# EAGLE schematic silentfan_with_relay (EAGLE 9.5.0)
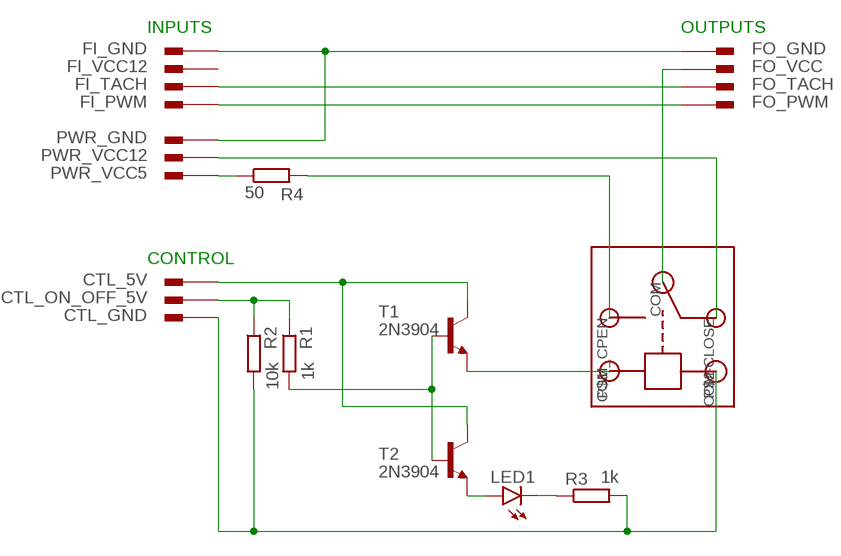
[diagram p0: schematic, sheet 1]

## Parts
CTL_5V  PIN1-2  [62221]
CTL_GND  PIN1-2  [62221]
CTL_ON_OFF_5V  PIN1-2  [62221]
FI_GND  PIN1-2  [62221]
FI_PWM  PIN1-2  [62221]
FI_TACH  PIN1-2  [62221]
FI_VCC12  PIN1-2  [62221]
FO_GND  PIN1-2  [62221]
FO_PWM  PIN1-2  [62221]
FO_TACH  PIN1-2  [62221]
FO_VCC  PIN1-2  [62221]
LED1  LED3MM  [LED3MM]
PWR_GND  PIN1-2  [62221]
PWR_VCC5  PIN1-2  [62221]
PWR_VCC12  PIN1-2  [62221]
R1  1k  R-EU_0204/2V  [0204V]
R2  10k  R-EU_0204/2V  [0204V]
R3  1k  R-EU_0204/2V  [0204V]
R4  50  R-EU_0309/12  [0309/12]
T1  2N3904  [TO92]
T2  2N3904  [TO92]
U$1  RELAY  [RELAY]

## Nets
N$1: FI_GND.1 FO_GND.1 PWR_GND.1
N$2: R4.2 U$1.COM_CPEN(COM-OPEN)
N$3: FI_TACH.1 FO_TACH.1
N$4: FI_PWM.1 FO_PWM.1
N$5: PWR_VCC12.1 U$1.COM-CLOSE
N$6: R1.2 T1.2(B) T2.2(B)
N$7: CTL_ON_OFF_5V.1 R1.1 R2.1
N$8: PWR_VCC5.1 R4.1
N$9: FO_VCC.1 U$1.COM
N$10: CTL_GND.1 R2.2 R3.2 U$1.P$2(GND)
N$11: T1.3(E) U$1.P$1(IN)
N$12: LED1.A T2.3(E)
N$13: LED1.K(C) R3.1
N$14: CTL_5V.1 T1.1(C) T2.1(C)
Unconnected: FI_VCC12.1

## Notes on the sheet
- INPUTS | OUTPUTS
- CONTROL

## Library data of the parts
CTL_5V CTL_GND CTL_ON_OFF_5V FI_GND FI_PWM FI_TACH FI_VCC12 FO_GND FO_PWM FO_TACH FO_VCC PWR_GND PWR_VCC5 PWR_VCC12 = con-faston:PIN1-2: CONN TAB FASTON BRASS .187 PCB TAB, FSSTON, DUAL STAKE, .187 SERIES Digi-Key Part Number: A24734CT-ND Source: Tyco Electronics Corporation .. ENG_CD_62221_R.pdf http://search.digikey.com/scripts/DkSearch/dksus.dll?Detail&name=A24734CT-ND; MF: TYCO ELECTRONICS; MPN: 62221-1; OC_FARNELL: unknown; OC_NEWARK: 16H2318
LED1 = led:LED: LED OSRAM: - CHIPLED LG R971, LG N971, LY N971, LG Q971, LY Q971, LO R971, LY R971 LH N974, LH R974 LS Q976, LO Q976, LY Q976 LO Q996 - Hyper CHIPLED LW Q18S LB Q993, LB Q99A, LB R99A - SideLED LS A670, LO A670, LY A670, LG A670, LP A670 LB A673, LV A673, LT A673, LW A673 LH A674 LY A675 LS A676, LA A676, LO A676, LY A676, LW A676 LS A679, LY A679, LG A679 - Hyper Micro SIDELED® LS Y876, LA Y876, LO Y876, LY Y876 LT Y87S - SmartLED LW L88C, LW L88S LB L89C, LB L89S, LG L890 LS L89K, LO L89K, LY L89K LS L896, LA L896, LO L896, LY L896 - TOPLED LS T670, LO T670, LY T670, LG T670, LP T670 LSG T670, LSP T670, LSY T670, LOP T670, LYG T670 LG T671, LOG T671, LSG T671 LB T673, LV T673, LT T673, LW T673 LH T674 LS T676, LA T676, LO T676, LY T676, LB T676, LH T676, LSB T676, LW T676 LB T67C, LV T67C, LT T67C, LS T67K, LO T67K, LY T67K, LW E67C LS E67B, LA E67B, LO E67B, LY E67B, LB E67C, LV E67C, LT E67C LW T67C LS T679, LY T679, LG T679 LS T770, LO T770, LY T770, LG T770, LP T770 LB T773, LV T773, LT T773, LW T773 LH T774 LS E675, LA E675, LY E675, LS T675 LS T776, LA T776, LO T776, LY T776, LB T776 LHGB T686 LT T68C, LB T68C - Hyper Mini TOPLED® LB M676 - Mini TOPLED Santana® LG M470 LS M47K, LO M47K, LY M47K Source: http://www.osram.convergy.de LUXEON: - LUMILED® LXK2-PW12-R00, LXK2-PW12-S00, LXK2-PW14-U00, LXK2-PW14-V00 LXK2-PM12-R00, LXK2-PM12-S00, LXK2-PM14-U00 LXK2-PE12-Q00, LXK2-PE12-R00, LXK2-PE12-S00, LXK2-PE14-T00, LXK2-PE14-U00 LXK2-PB12-K00, LXK2-PB12-L00, LXK2-PB12-M00, LXK2-PB14-N00, LXK2-PB14-P00, LXK2-PB14-Q00 LXK2-PR12-L00, LXK2-PR12-M00, LXK2-PR14-Q00, LXK2-PR14-R00 LXK2-PD12-Q00, LXK2-PD12-R00, LXK2-PD12-S00 LXK2-PH12-R00, LXK2-PH12-S00 LXK2-PL12-P00, LXK2-PL12-Q00, LXK2-PL12-R00 Source: www.luxeon.com KINGBRIGHT: KA-3528ASYC Source: www.kingbright.com
R1-R4 = resistor:R-EU_: RESISTOR, European symbol
T1 T2 = transistor:2N3904: NPN TRANSISTOR
U$1 = RELAY:RELAY